# EAGLE schematic proyek gempa bumi (EAGLE 9.6.2)
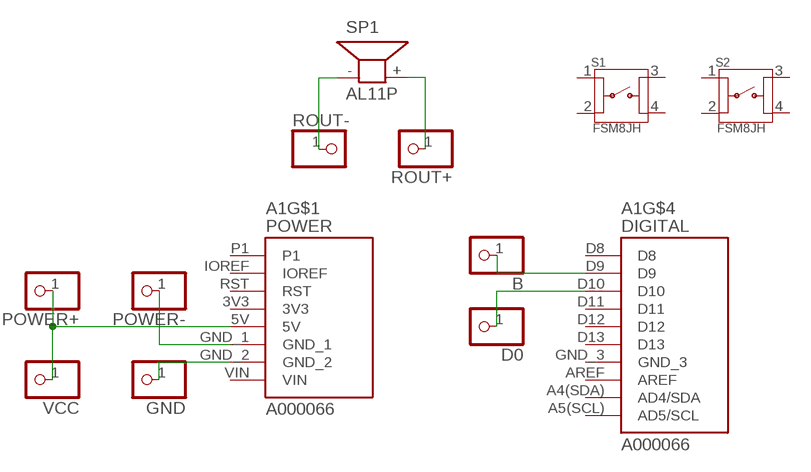
[diagram p0: schematic, sheet 1]

## Parts
A1  A000066  [ARDUINO_A000066]
B  PINHD-1X1  [1X01]
D0  PINHD-1X1  [1X01]
GND  PINHD-1X1  [1X01]
POWER+  PINHD-1X1  [1X01]
POWER-  PINHD-1X1  [1X01]
ROUT+  PINHD-1X1  [1X01]
ROUT-  PINHD-1X1  [1X01]
S1  FSM8JH  [SW_FSM8JH]
S2  FSM8JH  [SW_FSM8JH]
SP1  AL11P  [AL11P]
VCC  PINHD-1X1  [1X01]

## Nets
N$1: A1.D9 B.1
N$2: A1.D10 D0.1
N$3: A1.5V POWER+.1 VCC.1
N$4: A1.GND_2 GND.1
N$5: A1.GND_1 POWER-.1
N$6: ROUT+.1 SP1.+
N$7: ROUT-.1 SP1.-
Unconnected: A1.A0 A1.A1 A1.A2 A1.A3 A1.A4 A1.A4(SDA)(AD4/SDA) A1.A5 A1.A5(SCL)(AD5/SCL) A1.AREF A1.D0 A1.D1 A1.D2 A1.D3 A1.D4 A1.D5 A1.D6 A1.D7 A1.D8 A1.D11 A1.D12 A1.D13 A1.IOREF A1.P1 A1.RST S1.1 S1.2 S1.3 S1.4 S2.1 S2.2 S2.3 S2.4

## Power pins joined to a net without a drawn wire
3V3: A1.3V3
GND_3: A1.GND_3
VIN: A1.VIN

## Library data of the parts
A1 = A000066:A000066: Microcontroller board, Uno [Arduino] A000066 Microcontroller board, Uno 7640152110092 Check prices <https://pricing.snapeda.com/parts/A000066/Arduino/view-part?ref=eda> Check prices <https://pricing.snapeda.com/parts/A000066/Arduino/view-part?ref=eda> Check availability <https://pricing.snapeda.com/parts/ARDUINO%20UNO%20REV3/Arduino/view-part?ref=eda>; AVAILABILITY: In Stock; CHECK_PRICES: https://www.snapeda.com/parts/ARDUINO%20UNO%20REV3/Arduino/view-part/?ref=eda; DESCRIPTION: Microcontroller board based on the ATmega328P.; MF: Arduino; MP: ARDUINO UNO REV3; PACKAGE: Non-Standard Arduino; PRICE: None; SNAPEDA_LINK: https://www.snapeda.com/parts/ARDUINO%20UNO%20REV3/Arduino/view-part/?ref=snap
B D0 GND POWER+ POWER- ROUT+ ROUT- VCC = pinhead:PINHD-1X1: PIN HEADER
S1 S2 = FSM8JH:FSM8JH: Switch, Pushbutton, Tactile, SPST, Thru Hole, Vertical, 6MM, Black Check availability <https://pricing.snapeda.com/parts/FSM8JH/TE%20Connectivity/view-part?ref=eda>; AVAILABILITY: In Stock; CHECK_PRICES: https://www.snapeda.com/parts/FSM8JH/TE+Connectivity+ALCOSWITCH+Switches/view-part/?ref=eda; DESCRIPTION: Switch,Pushbutton,Tactile,SPST,Thru Hole,Vertical,6MM,Black | TE Connectivity FSM8JH; MF: TE Connectivity; MP: FSM8JH; PACKAGE: None; PRICE: None; SNAPEDA_LINK: https://www.snapeda.com/parts/FSM8JH/TE+Connectivity+ALCOSWITCH+Switches/view-part/?ref=snap
SP1 = buzzer:AL11P: SPEAKER Source: Buerklin; OC_FARNELL: unknown; OC_NEWARK: unknown